# Altium schematic sheet main.SchDoc
size A4
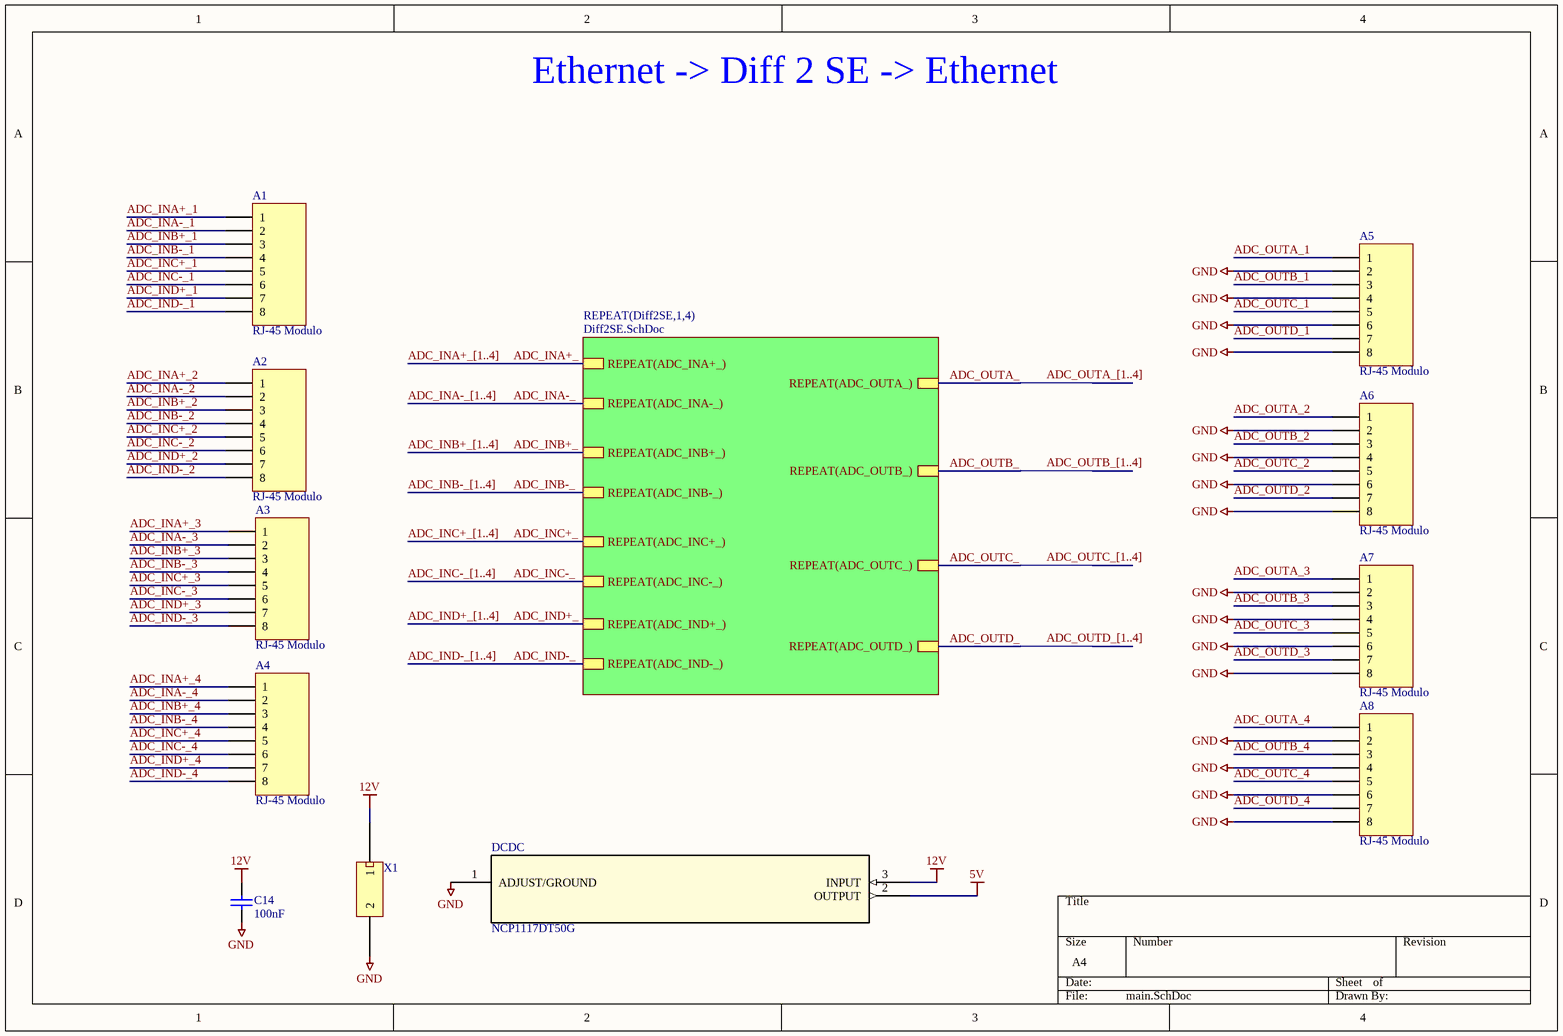
[diagram p0: main.SchDoc]

## Parts
A1  RJ-45 Modulo  [RJ45_RJHSE5E80]
A2  RJ-45 Modulo  [RJ45_RJHSE5E80]
A3  RJ-45 Modulo  [RJ45_RJHSE5E80]
A4  RJ-45 Modulo  [RJ45_RJHSE5E80]
A5  RJ-45 Modulo  [RJ45_RJHSE5E80]
A6  RJ-45 Modulo  [RJ45_RJHSE5E80]
A7  RJ-45 Modulo  [RJ45_RJHSE5E80]
A8  RJ-45 Modulo  [RJ45_RJHSE5E80]
C14  100nF  [CAP_0805]
DCDC  NCP1117DT50G  [DPAK_ONS]
X1  Connector 2x1 R/A  [CON_WR-MPC4-649002227222]  (value not drawn)

## Sub-sheets
REPEAT(Diff2SE,1,4) = Diff2SE.SchDoc: REPEAT(ADC_OUTA_), REPEAT(ADC_INA+_), REPEAT(ADC_INA-_), REPEAT(ADC_INB+_), REPEAT(ADC_INB-_), REPEAT(ADC_INC+_), REPEAT(ADC_INC-_), REPEAT(ADC_IND+_), REPEAT(ADC_IND-_), REPEAT(ADC_OUTB_), REPEAT(ADC_OUTC_), REPEAT(ADC_OUTD_)

## Nets
5V: DCDC.2(OUTPUT)
12V: C14.1 DCDC.3(INPUT) X1.1
GND: A5.2 A5.4 A5.6 A5.8 A6.2 A6.4 A6.6 A6.8 A7.2 A7.4 A7.6 A7.8 A8.2 A8.4 A8.6 A8.8 C14.2 DCDC.1(ADJUST/GROUND) X1.2
ADC_INA+_: sheet REPEAT(Diff2SE,1,4)/REPEAT(ADC_INA+_)
ADC_INA+_1: A1.1
ADC_INA+_2: A2.1
ADC_INA+_3: A3.1
ADC_INA+_4: A4.1
ADC_INA-_: sheet REPEAT(Diff2SE,1,4)/REPEAT(ADC_INA-_)
ADC_INA-_1: A1.2
ADC_INA-_2: A2.2
ADC_INA-_3: A3.2
ADC_INA-_4: A4.2
ADC_INB+_: sheet REPEAT(Diff2SE,1,4)/REPEAT(ADC_INB+_)
ADC_INB+_1: A1.3
ADC_INB+_2: A2.3
ADC_INB+_3: A3.3
ADC_INB+_4: A4.3
ADC_INB-_: sheet REPEAT(Diff2SE,1,4)/REPEAT(ADC_INB-_)
ADC_INB-_1: A1.4
ADC_INB-_2: A2.4
ADC_INB-_3: A3.4
ADC_INB-_4: A4.4
ADC_INC+_: sheet REPEAT(Diff2SE,1,4)/REPEAT(ADC_INC+_)
ADC_INC+_1: A1.5
ADC_INC+_2: A2.5
ADC_INC+_3: A3.5
ADC_INC+_4: A4.5
ADC_INC-_: sheet REPEAT(Diff2SE,1,4)/REPEAT(ADC_INC-_)
ADC_INC-_1: A1.6
ADC_INC-_2: A2.6
ADC_INC-_3: A3.6
ADC_INC-_4: A4.6
ADC_IND+_: sheet REPEAT(Diff2SE,1,4)/REPEAT(ADC_IND+_)
ADC_IND+_1: A1.7
ADC_IND+_2: A2.7
ADC_IND+_3: A3.7
ADC_IND+_4: A4.7
ADC_IND-_: sheet REPEAT(Diff2SE,1,4)/REPEAT(ADC_IND-_)
ADC_IND-_1: A1.8
ADC_IND-_2: A2.8
ADC_IND-_3: A3.8
ADC_IND-_4: A4.8
ADC_OUTA_: sheet REPEAT(Diff2SE,1,4)/REPEAT(ADC_OUTA_)
ADC_OUTA_1: A5.1
ADC_OUTA_2: A6.1
ADC_OUTA_3: A7.1
ADC_OUTA_4: A8.1
ADC_OUTB_: sheet REPEAT(Diff2SE,1,4)/REPEAT(ADC_OUTB_)
ADC_OUTB_1: A5.3
ADC_OUTB_2: A6.3
ADC_OUTB_3: A7.3
ADC_OUTB_4: A8.3
ADC_OUTC_: sheet REPEAT(Diff2SE,1,4)/REPEAT(ADC_OUTC_)
ADC_OUTC_1: A5.5
ADC_OUTC_2: A6.5
ADC_OUTC_3: A7.5
ADC_OUTC_4: A8.5
ADC_OUTD_: sheet REPEAT(Diff2SE,1,4)/REPEAT(ADC_OUTD_)
ADC_OUTD_1: A5.7
ADC_OUTD_2: A6.7
ADC_OUTD_3: A7.7
ADC_OUTD_4: A8.7

## Buses and harness runs
bus ADC_INA+_[1..4]
bus ADC_INA-_[1..4]
bus ADC_INB+_[1..4]
bus ADC_INB-_[1..4]
bus ADC_INC+_[1..4]
bus ADC_INC-_[1..4]
bus ADC_IND+_[1..4]
bus ADC_IND-_[1..4]
bus ADC_OUTA_[1..4]
bus ADC_OUTB_[1..4]
bus ADC_OUTC_[1..4]
bus ADC_OUTD_[1..4]

## Notes on the sheet
- Ethernet -> Diff 2 SE -> Ethernet

## Library data of the parts
A1-A8 = RJ45_RJHSE5E80: Modulo RJ-45 RJHSE5E80; Manufacturer Part-Number: 1-338088-3; Manufacturer: Amphenol Commercial; Shielding: Shielded; Connector Type: Jack; Number of Ports: 1; Direction: Up; Gender: Female; Current Rating: 1.5A; Voltage Rating: 125V; Number of Positions: 8; Insulation Resistance: 500MR; Pitch: 2.03mm; LatestRevisionDate: 17-Jul-2002; LatestRevisionNote: Re-released for DXP Platform.; Publisher: Altium Limited; Digikey Part-Number: A99306CT-ND; Supplier 1: Digi-Key; Manufacturer Part Number: RJHSE5E80; Stock 1: 16396; Pricing 1: 1=1.28, 10=1.125, 25=1.0584, 50=1.0144, 100=0.9702, 250=0.882, 500=0.7938, 1000=0.7056, 2500=0.63945 (USD); Mount: Through Hole; Contact Plating: Gold; Contact Material: Bronze; Housing Material: Thermoplastic; Color: Black; Min Operating Temperature: -55°C; Max Operating Temperature: 85°C; Packaging: Tray; Termination: Solder; Number of Rows: 1; Package Quantity: 120; Number of Contacts: 8; Orientation: Right Angle; Flammability Rating: UL94 V-0; ComponentLink1URL: http://www.mouser.com/ds/2/18/Amphenol_RJHSE_BRO-311217.pdf?src-supplier=Mouser; ComponentLink1Description: http://www.mouser.com/ds/2/18/Amphenol_RJHSE_BRO-311217.pdf?src-supplier=Mouser; ComponentLink2URL: https://media.digikey.com/pdf/Data%20Sheets/Amphenol%20PDFs/RJHSE5E8x_Dwg.pdf?src-supplier=Digi-Key; ComponentLink2Description: https://media.digikey.com/pdf/Data%20Sheets/Amphenol%20PDFs/RJHSE5E8x_Dwg.pdf?src-supplier=Digi-Key; Supplier Part Number 1: RJHSE5E80-ND
C14 = Cap_0805: 0.1µF ±10% 50V Ceramic Capacitor X7R 0805 (2012 Metric); MF: KEMET; MFP: C0805C104K5RACTU; Created: 2020_06_15_DAarancibia; Package: 0805; Value: 100nF; Supplier 1: Digi-Key; Supplier Part Number 1: 399-1170-1-ND
DCDC = NCP1117DT50G: No Description Available; Mfr_Name: onsemi; RefDes: RefDes; Type: Type
X1 = Con_WR-MPC4_2x1: Connector Header Through Hole, Right Angle 2 position 0.165" (4.20mm); MPN: 649002227222; MF: Würth Elektronik; Created: 2020_06_14_DArancibia; Package: Through Hole, pitch 0.165" (4.20mm); Value: Connector 2x1 R/A; Supplier 1: Digi-Key; Supplier Part Number 1: 732-1937-ND